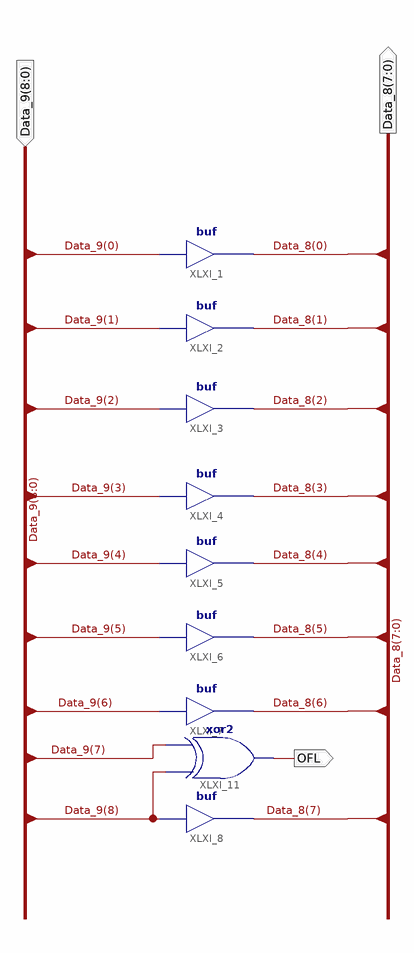
[diagram p0: schematic sheet 1]
// Xilinx ISE schematic Bit9_to_Bit8.sch (spartan3e) as structural Verilog: 9 symbols, 3 ports
module Bit9_to_Bit8 (
  input  [8:0] Data_9,
  output [7:0] Data_8,
  output OFL
);

  buf XLXI_1 (Data_8[0], Data_9[0]);
  buf XLXI_2 (Data_8[1], Data_9[1]);
  buf XLXI_3 (Data_8[2], Data_9[2]);
  buf XLXI_4 (Data_8[3], Data_9[3]);
  buf XLXI_5 (Data_8[4], Data_9[4]);
  buf XLXI_6 (Data_8[5], Data_9[5]);
  buf XLXI_7 (Data_8[6], Data_9[6]);
  buf XLXI_8 (Data_8[7], Data_9[8]);
  xor XLXI_11 (OFL, Data_9[8], Data_9[7]);
endmodule
